# Altium schematic sheet PowerSupply.SchDoc
size A3; SheetNumber: 1; SheetTotal: 7
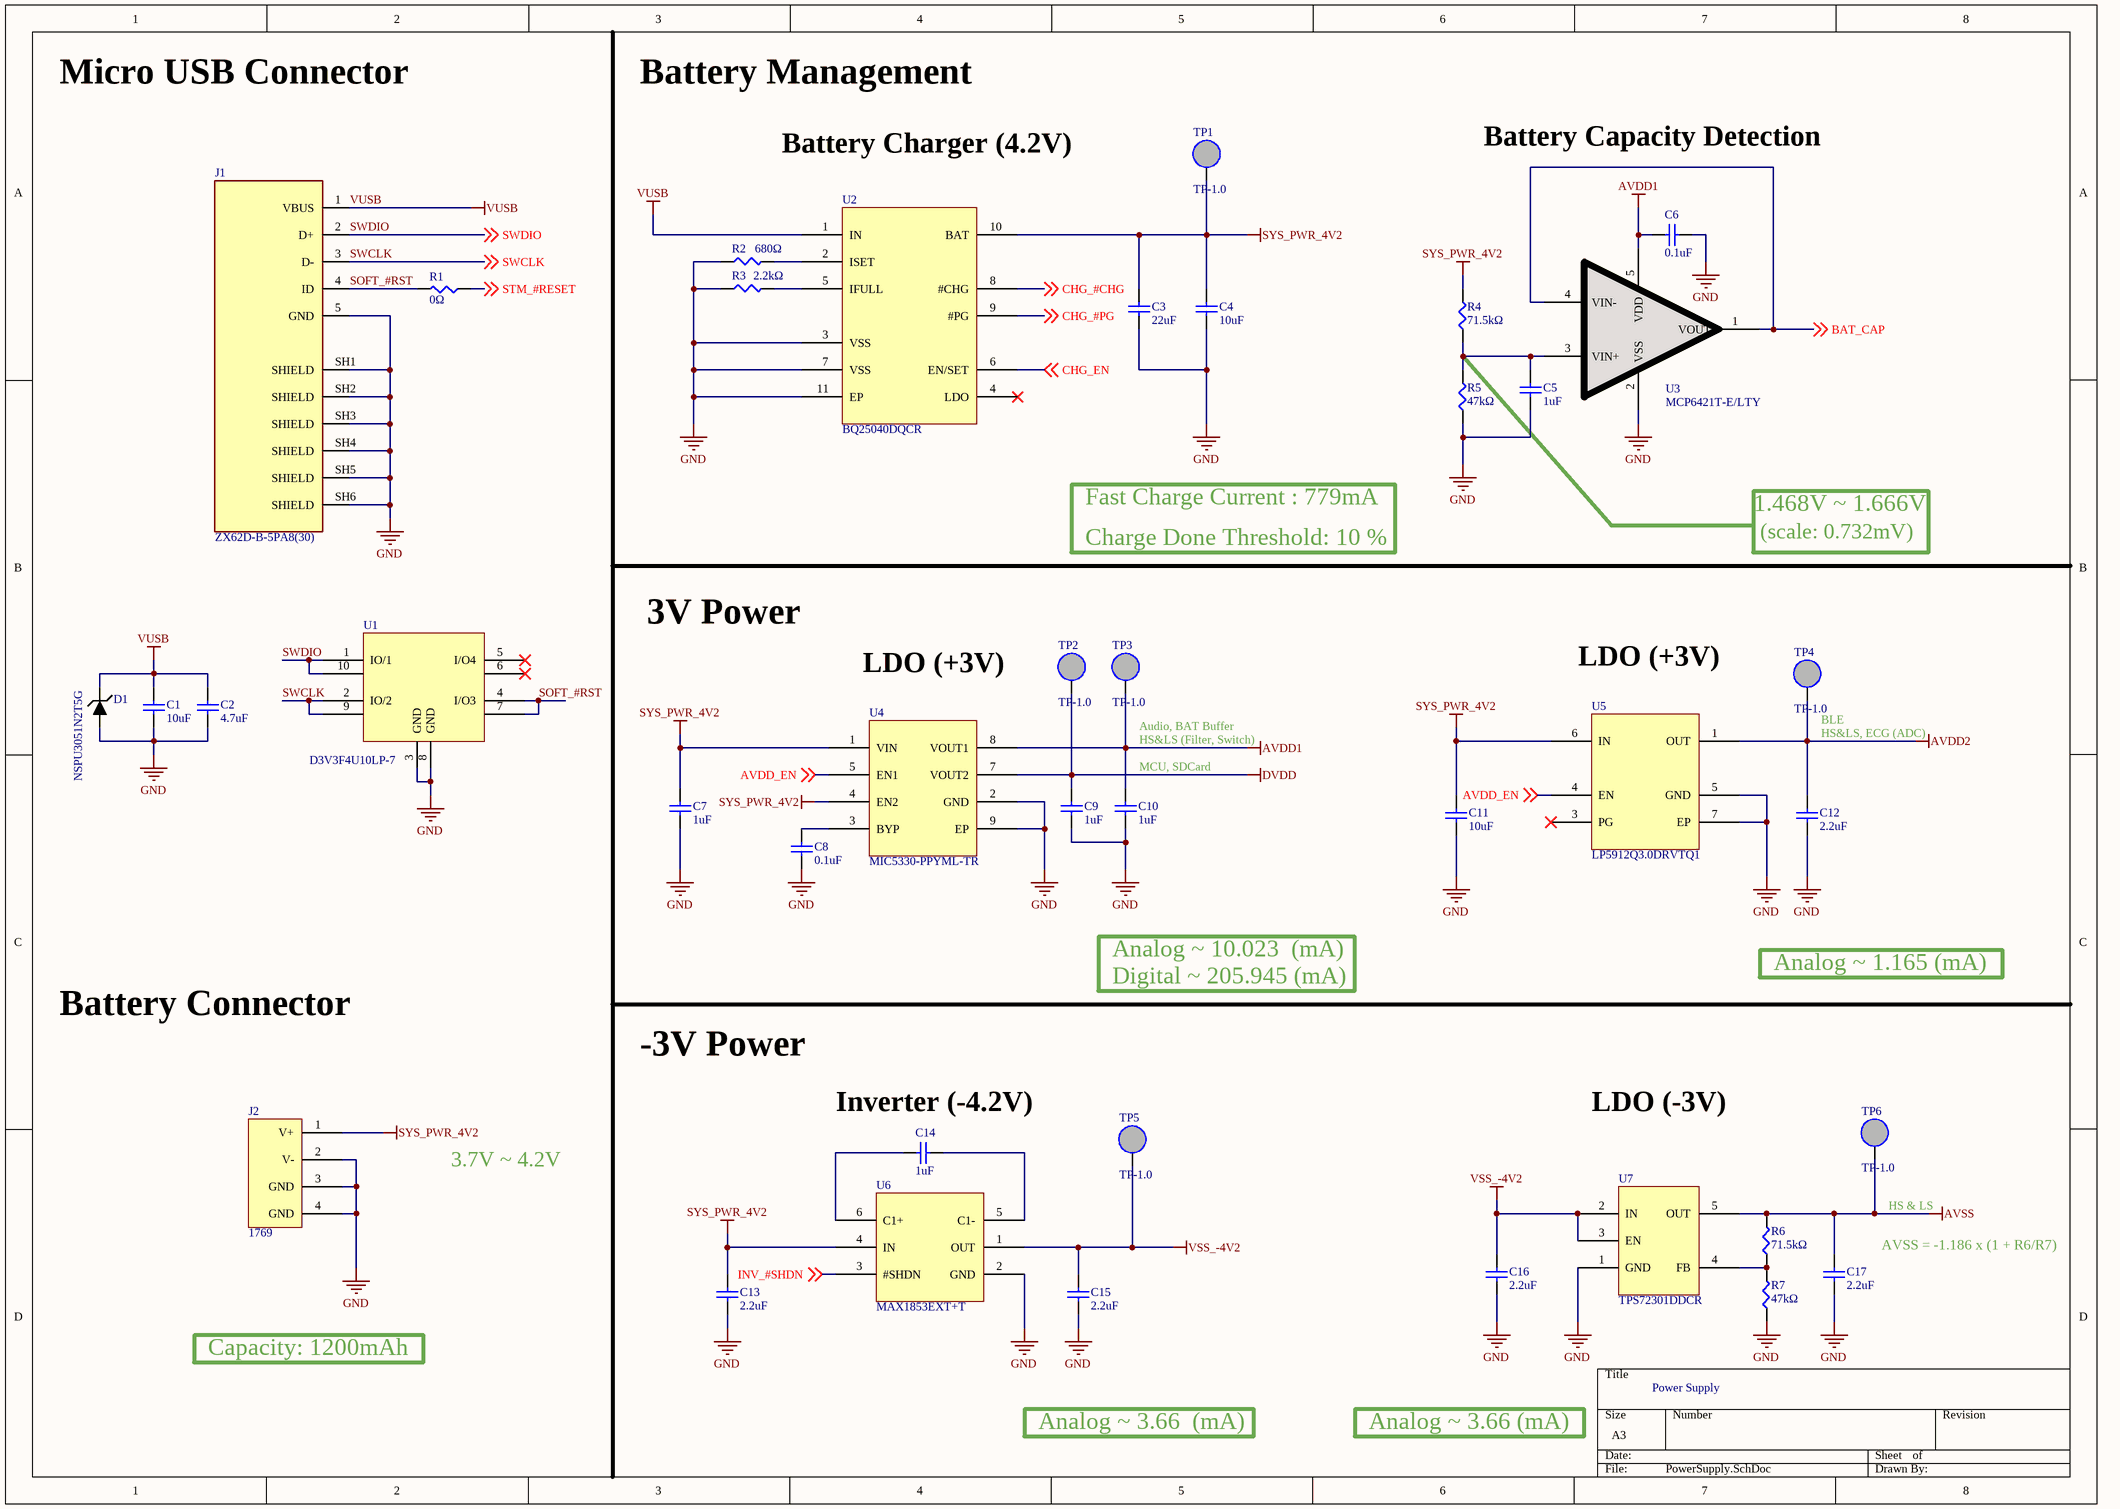
[diagram p0: PowerSupply.SchDoc]

## Parts
C1  10uF  [0603]
C2  4.7uF  [0603]
C3  22uF  [0603]
C4  10uF  [0603]
C5  1uF  [0402]
C6  0.1uF  [0402]
C7  1uF  [0402]
C8  0.1uF  [0402]
C9  1uF  [0402]
C10  1uF  [0402]
C11  10uF  [0603]
C12  2.2uF  [0402]
C13  2.2uF  [0402]
C14  1uF  [0402]
C15  2.2uF  [0402]
C16  2.2uF  [0402]
C17  2.2uF  [0402]
D1  NSPU3051N2T5G  [X2DFN-2(0.73-0.6x1.0x0.37)]
J1  ZX62D-B-5PA8(30)  [HIROSE_ZX62D-B-5PA8(30)]
J2  1769  [JST-PH 2-Pin]
R1  0Ω  [0402]
R2  680Ω  [0402]
R3  2.2kΩ  [0402]
R4  71.5kΩ  [0402]
R5  47kΩ  [0402]
R6  71.5kΩ  [0402]
R7  47kΩ  [0402]
TP1  TP-1.0  [Testpoint]  (no BOM)
TP2  TP-1.0  [Testpoint]  (no BOM)
TP3  TP-1.0  [Testpoint]  (no BOM)
TP4  TP-1.0  [Testpoint]  (no BOM)
TP5  TP-1.0  [Testpoint]  (no BOM)
TP6  TP-1.0  [Testpoint]  (no BOM)
U1  D3V3F4U10LP-7  [UDFN2510-10(0.5-1.0x2.5x0.575)]
U2  BQ25040DQCR  [WSON-10(0.5-2.0x3.0x0.8)]
U3  MCP6421T-E/LTY  [SC-70-5]
U4  MIC5330-PPYML-TR  [VFDFN-8]
U5  LP5912Q3.0DRVTQ1  [WSON-6]
U6  MAX1853EXT+T  [SC70-6]
U7  TPS72301DDCR  [SOT-23-5]

## Nets
AVDD1: C6.2 C10.2 TP3.1 U3.5(VDD) U4.8(VOUT1)
AVDD2: C12.2 TP4.1 U5.1(OUT)
AVSS: C17.2 R6.2 TP6.1 U7.5(OUT)
DVDD: C9.2 TP2.1 U4.7(VOUT2)
GND: C1.1 C2.1 C3.1 C4.1 C5.1 C6.1 C7.1 C8.1 C9.1 C10.1 C11.1 C12.1 C13.1 C15.1 C16.1 C17.1 D1.2(ANODE) J1.5(GND) J1.SH1(SHIELD) J1.SH2(SHIELD) J1.SH3(SHIELD) J1.SH4(SHIELD) J1.SH5(SHIELD) J1.SH6(SHIELD) J2.2(V-) J2.3(GND) J2.4(GND) R2.1 R3.1 R5.1 R7.1 U1.3(GND) U1.8(GND) U2.3(VSS) U2.7(VSS) U2.11(EP) U3.2(VSS) U4.2(GND) U4.9(EP) U5.5(GND) U5.7(EP) U6.2(GND) U7.1(GND)
SYS_PWR_4V2: C3.2 C4.2 C7.2 C11.2 C13.2 J2.1(V+) R4.2 TP1.1 U2.10(BAT) U4.1(VIN) U4.4(EN2) U5.6(IN) U6.4(IN)
VSS_-4V2: C15.2 C16.2 TP5.1 U6.1(OUT) U7.2(IN) U7.3(EN)
VUSB: C1.2 C2.2 D1.1(CATHODE) J1.1(VBUS) U2.1(IN)
AVDD_EN: U4.5(EN1) U5.4(EN) ; off-sheet AVDD_EN
BAT_CAP: U3.1(VOUT) U3.4(VIN-) ; off-sheet BAT_CAP
CHG_#CHG: U2.8(#CHG) ; off-sheet CHG_#CHG
CHG_#PG: U2.9(#PG) ; off-sheet CHG_#PG
CHG_EN: U2.6(EN/SET) ; off-sheet CHG_EN
INV_#SHDN: U6.3(#SHDN) ; off-sheet INV_#SHDN
SOFT_#RST: J1.4(ID) R1.2 U1.4(I/O3) U1.7
STM_#RESET: R1.1 ; off-sheet STM_#RESET
SWCLK: J1.3(D-) U1.2(IO/2) U1.9 ; off-sheet SWCLK
SWDIO: J1.2(D+) U1.1(IO/1) U1.10 ; off-sheet SWDIO
NetC5_2: C5.2 R4.1 R5.2 U3.3(VIN+)
NetC8_2: C8.2 U4.3(BYP)
NetC14_1: C14.1 U6.6(C1+)
NetC14_2: C14.2 U6.5(C1-)
NetR2_2: R2.2 U2.2(ISET)
NetR3_2: R3.2 U2.5(IFULL)
NetR6_1: R6.1 R7.2 U7.4(FB)

Not connected (* = marked no-connect by the designer): U1 5(I/O4)* 6*; U2 4(LDO)*; U5 3(PG)*

## Notes on the sheet
- Micro USB Connector
- Battery Management
- Battery Charger (4.2V)
- Battery Capacity Detection
- Fast Charge Current : 779mA
- 1.468V ~ 1.666V
- Charge Done Threshold: 10 %
- (scale: 0.732mV)
- 3V Power
- LDO (+3V)
- (near TP4) BLE
- (near TP3) Audio, BAT Buffer
- (near C10) MCU, SDCard
- HS&LS (Filter, Switch)
- (near TP4) HS&LS, ECG (ADC)
- Digital ~ 205.945 (mA)
- Analog ~ 10.023  (mA)
- Analog ~ 1.165 (mA)
- Battery Connector
- -3V Power
- (near C14) Inverter (-4.2V)
- LDO (-3V)
- 3.7V ~ 4.2V
- (near C17) AVSS = -1.186 x (1 + R6/R7)
- HS & LS
- Capacity: 1200mAh
- Power Supply
- Analog ~ 3.66  (mA)
- Analog ~ 3.66 (mA)

## Library data of the parts
C1-C4 C11 = 0603: MLCC-0603
C5-C10 C12-C17 = 0402: MLCC-0402
D1 = NSPU3051N2T5G: 0016-11-ESD-01-D3V3F4U10LP-7; AuthorBy: yjlab
J1 = ZX62D-B-5PA8(30): USB Connectors 5P RECEPTACLE
J2 = 1769: Battery Connector, JST-PH 2 Pin
R1-R7 = 0402: Resistor_SMD_0402; AuthorBy: yjlab
TP1-TP6 = Testpoint
U1 = D3V3F4U10LP-7: 0017-11-ESD-01-D3V3F4U10LP-7; AuthorBy: yjlab
U2 = BQ25040DQCR: 0001-07-BAC-01-BQ25040DQCR; AuthorBy: yjlab
U3 = MCP6421T-E/LTY: 4.4 µA/Amplifier, 90 kHz Op Amp
U4 = MIC5330-PPYML-TR: Voltage Regulators Dual 300mA LDO, 2 Output: (3V, 3V)
U5 = LP5912Q3.0DRVTQ1: LDO Voltage Regulators Automotive 500-mA, low-noise, low-IQ, low-dropout voltage regulator with reverse current protection
U6 = MAX1853EXT+T: Switching Voltage Regulators SC70 Inverting Charge Pumps with Shutdown, Switching Frequency 200kHz
U7 = TPS72301DDCR: Negative Output LDO, Adjustable Output